# EAGLE schematic Aegis PCB - 1 v58 (EAGLE 9.7.0)

## Sheet 1 of 12: Battery Charger
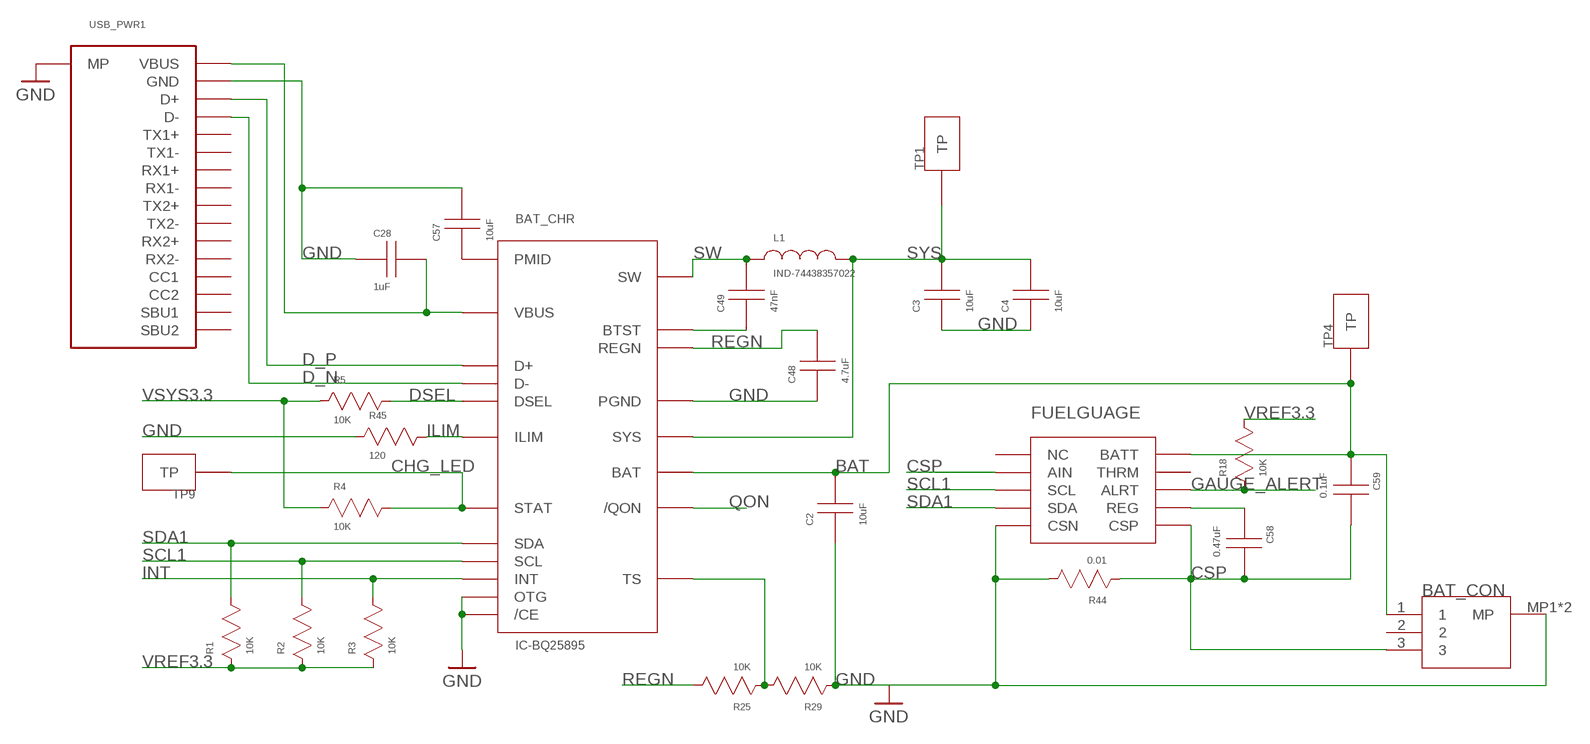
[diagram p0: schematic, sheet 1]

### Parts
BAT_CHR  IC-BQ25895  [IC-BQ25895]
BAT_CON  CONN-AUH03  [CONN_AUH03]
C2  10uF  CAP-603  [CAP-603]
C3  10uF  CAP-603  [CAP-603]
C4  10uF  CAP-603  [CAP-603]
C28  1uF  CAP-603  [CAP-603]
C48  4.7uF  CAP-603  [CAP-603]
C49  47nF  CAP-603  [CAP-603]
C57  10uF  CAP-603  [CAP-603]
C58  0.47uF  CAP-603  [CAP-603]
C59  0.1uF  CAP-603  [CAP-603]
FUELGUAGE  IC-MAX17055  [IC-MAX17055]
L1  IND-74438357022  [IND-74438357022]
R1  10K  RES-603  [RES-603]
R2  10K  RES-603  [RES-603]
R3  10K  RES-603  [RES-603]
R4  10K  RES-603  [RES-603]
R5  10K  RES-603  [RES-603]
R18  10K  RES-603  [RES-603]
R25  10K  RES-603  [RES-603]
R29  10K  RES-603  [RES-603]
R44  0.01  RES-603  [RES-603]
R45  120  RES-603  [RES-603]
TP1  TESTPOINT  [TESTPOINT]
TP4  TESTPOINT  [TESTPOINT]
TP9  TESTPOINT  [TESTPOINT]
USB_PWR1  USBC-USB-C31-S-RA-CS1D-BK-T/R  [USBC-USB-C31-S-RA-CS1D-BK-T/R]

### Nets
BAT: BAT_CHR.BAT1(BAT) BAT_CHR.BAT2(BAT) BAT_CON.1 C2.C C59.A FUELGUAGE.BATT TP4.TP
CHG_LED: BAT_CHR.STAT R4.C TP9.TP ; also sheet 10
CSP: BAT_CON.3 C58.C C59.C FUELGUAGE.AIN FUELGUAGE.CSP FUELGUAGE.EP(CSP) R44.A
D_N: BAT_CHR.D- USB_PWR1.D- USB_PWR1.D-_2(D-)
D_P: BAT_CHR.D+ USB_PWR1.D+ USB_PWR1.D+_2(D+)
DSEL: BAT_CHR.DSEL R5.C
GAUGE_ALERT: FUELGUAGE.ALRT R18.A ; also sheet 8
GND: BAT_CHR./CE BAT_CHR.OTG BAT_CHR.PGND1(PGND) BAT_CHR.PGND2(PGND) BAT_CHR.PWRPAD(PGND) BAT_CON.MP1(MP) BAT_CON.MP2(MP) C2.A C3.A C4.A C28.A C48.A C57.C FUELGUAGE.CSN R29.A R44.C R45.A USB_PWR1.GND_1(GND) USB_PWR1.GND_2(GND) USB_PWR1.GND_3(GND) USB_PWR1.GND_4(GND) USB_PWR1.MP_1(MP) USB_PWR1.MP_2(MP) USB_PWR1.MP_3(MP) USB_PWR1.MP_4(MP) ; also sheet 2,3,4,5,6,7,8,9,10,11,12
ILIM: BAT_CHR.ILIM R45.C
INT: BAT_CHR.INT R3.C ; also sheet 8
N$1: BAT_CHR.BTST C49.A
N$2: BAT_CHR.VBUS C28.C USB_PWR1.VBUS_1(VBUS) USB_PWR1.VBUS_2(VBUS) USB_PWR1.VBUS_3(VBUS) USB_PWR1.VBUS_4(VBUS)
N$4: BAT_CHR.TS R25.A R29.C
N$11: BAT_CHR.PMID C57.A
N$67: C58.A FUELGUAGE.REG
QON: BAT_CHR./QON
REGN: BAT_CHR.REGN C48.C R25.C
SCL1: BAT_CHR.SCL FUELGUAGE.SCL R2.C ; also sheet 8
SDA1: BAT_CHR.SDA FUELGUAGE.SDA R1.C ; also sheet 8
SW: BAT_CHR.SW1(SW) BAT_CHR.SW2(SW) C49.C L1.A
SYS: BAT_CHR.SYS1(SYS) BAT_CHR.SYS2(SYS) C3.C C4.C L1.C TP1.TP ; also sheet 2,3
VREF3.3: R1.A R2.A R3.A R18.C ; also sheet 4,9,10,11,12
VSYS3.3: R4.A R5.A ; also sheet 3,4,10
Unconnected: BAT_CON.2 FUELGUAGE.NC FUELGUAGE.THRM USB_PWR1.CC1 USB_PWR1.CC2 USB_PWR1.RX1+ USB_PWR1.RX1- USB_PWR1.RX2+ USB_PWR1.RX2- USB_PWR1.SBU1 USB_PWR1.SBU2 USB_PWR1.TX1+ USB_PWR1.TX1- USB_PWR1.TX2+ USB_PWR1.TX2-

## Sheet 2 of 12: 5V Regulator
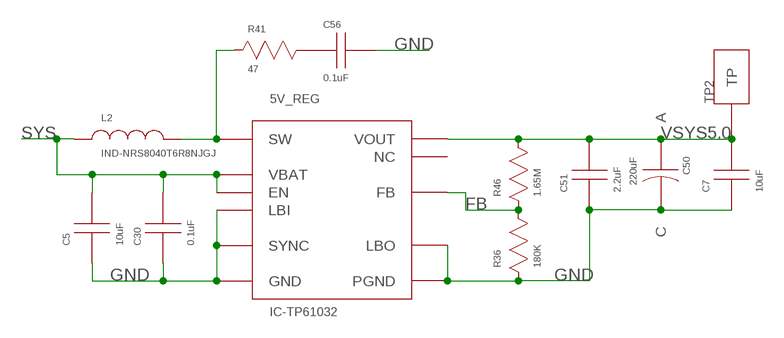
[diagram p1: schematic, sheet 2]

### Parts
5V_REG  IC-TP61032  [IC-TPS61032]
C5  10uF  CAP-603  [CAP-603]
C7  10uF  CAP-603  [CAP-603]
C30  0.1uF  CAP-603  [CAP-603]
C50  220uF  CAP-TAN-1411  [CAP-TAN-1411]
C51  2.2uF  CAP-603  [CAP-603]
C56  0.1uF  CAP-603  [CAP-603]
L2  IND-NRS8040T6R8NJGJ  [IND-NRS8040T6R8NJGJ]
R36  180K  RES-603  [RES-603]
R41  47  RES-603  [RES-603]
R46  1.65M  RES-603  [RES-603]
TP2  TESTPOINT  [TESTPOINT]

### Nets
FB: 5V_REG.FB R36.C R46.A
GND: 5V_REG.GND 5V_REG.LBI 5V_REG.LBO 5V_REG.PGND1(PGND) 5V_REG.PGND2(PGND) 5V_REG.PGND3(PGND) 5V_REG.PWRPAD(PGND) 5V_REG.SYNC C5.A C7.A C30.A C50.C C51.A C56.C R36.A ; also sheet 1,3,4,5,6,7,8,9,10,11,12
N$6: C56.A R41.C
SNUB: 5V_REG.SW1(SW) 5V_REG.SW2(SW) L2.C R41.A
SYS: 5V_REG.EN 5V_REG.VBAT C5.C C30.C L2.A ; also sheet 1,3
VSYS5.0: 5V_REG.VOUT1(VOUT) 5V_REG.VOUT2(VOUT) 5V_REG.VOUT3(VOUT) C7.C C50.A C51.C R46.C TP2.TP ; also sheet 4
Unconnected: 5V_REG.NC

## Sheet 3 of 12: 3.3V Regulator
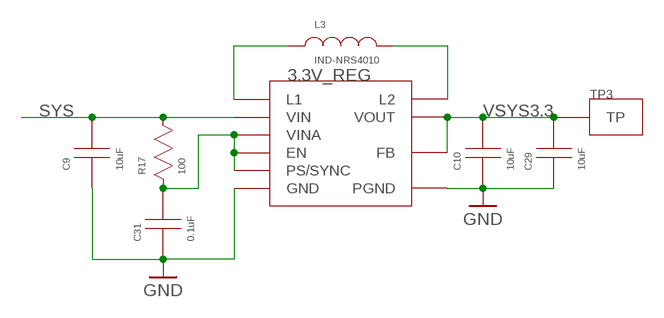
[diagram p2: schematic, sheet 3]

### Parts
3.3V_REG  IC-TPS63001DRCR  [IC-TPS63001DRCR]
C9  10uF  CAP-603  [CAP-603]
C10  10uF  CAP-603  [CAP-603]
C29  10uF  CAP-603  [CAP-603]
C31  0.1uF  CAP-603  [CAP-603]
L3  IND-NRS4010  [IND-NRS4010]
R17  100  RES-603  [RES-603]
TP3  TESTPOINT  [TESTPOINT]

### Nets
GND: 3.3V_REG.GND 3.3V_REG.PGND 3.3V_REG.PGND_1(PGND) 3.3V_REG.PGND_2(PGND) 3.3V_REG.PGND_3(PGND) 3.3V_REG.PGND_4(PGND) 3.3V_REG.PGND_5(PGND) C9.A C10.A C29.A C31.A ; also sheet 1,2,4,5,6,7,8,9,10,11,12
N$8: 3.3V_REG.EN 3.3V_REG.PS/SYNC 3.3V_REG.VINA C31.C R17.A
N$63: 3.3V_REG.L1 L3.A
N$66: 3.3V_REG.L2 L3.C
SYS: 3.3V_REG.VIN C9.C R17.C ; also sheet 1,2
VSYS3.3: 3.3V_REG.FB 3.3V_REG.VOUT C10.C C29.C TP3.TP ; also sheet 1,4,10

## Sheet 4 of 12: Power Switch
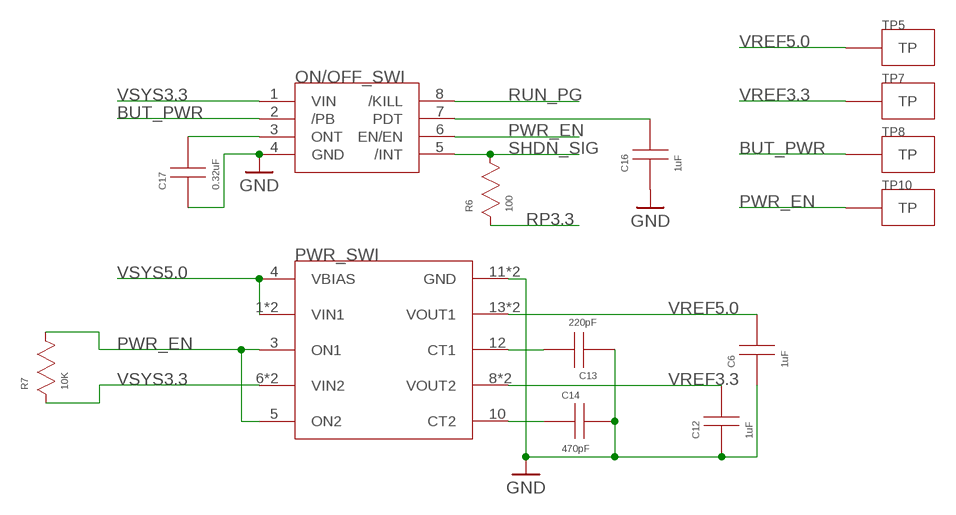
[diagram p3: schematic, sheet 4]

### Parts
C6  1uF  CAP-603  [CAP-603]
C12  1uF  CAP-603  [CAP-603]
C13  220pF  CAP-603  [CAP-603]
C14  470pF  CAP-603  [CAP-603]
C16  1uF  CAP-603  [CAP-603]
C17  0.32uF  CAP-603  [CAP-603]
ON/OFF_SWI  IC-LTC2954  [IC-LTC2954]
PWR_SWI  IC-TPS22976  [IC-TPS22976]
R6  100  RES-603  [RES-603]
R7  10K  RES-603  [RES-603]
TP5  TESTPOINT  [TESTPOINT]
TP7  TESTPOINT  [TESTPOINT]
TP8  TESTPOINT  [TESTPOINT]
TP10  TESTPOINT  [TESTPOINT]

### Nets
BUT_PWR: ON/OFF_SWI.2(/PB) TP8.TP ; also sheet 10
GND: C6.A C12.A C13.A C14.C C16.A C17.A ON/OFF_SWI.4(GND) PWR_SWI.11(GND) PWR_SWI.15(GND) ; also sheet 1,2,3,5,6,7,8,9,10,11,12
N$3: C13.C PWR_SWI.12(CT1)
N$5: C14.A PWR_SWI.10(CT2)
N$7: C16.C ON/OFF_SWI.7(PDT)
N$9: C17.C ON/OFF_SWI.3(ONT)
PWR_EN: ON/OFF_SWI.6(EN/EN) PWR_SWI.3(ON1) PWR_SWI.5(ON2) R7.C TP10.TP
RP3.3: R6.A ; also sheet 6,8,9
RUN_PG: ON/OFF_SWI.8(/KILL) ; also sheet 8
SHDN_SIG: ON/OFF_SWI.5(/INT) R6.C ; also sheet 8
VREF3.3: C12.C PWR_SWI.8(VOUT2) PWR_SWI.9(VOUT2) TP7.TP ; also sheet 1,9,10,11,12
VREF5.0: C6.C PWR_SWI.13(VOUT1) PWR_SWI.14(VOUT1) TP5.TP ; also sheet 7,8,11
VSYS3.3: ON/OFF_SWI.1(VIN) PWR_SWI.6(VIN2) PWR_SWI.7(VIN2) R7.A ; also sheet 1,3,10
VSYS5.0: PWR_SWI.1(VIN1) PWR_SWI.2(VIN1) PWR_SWI.4(VBIAS) ; also sheet 2

## Sheet 5 of 12: Audio
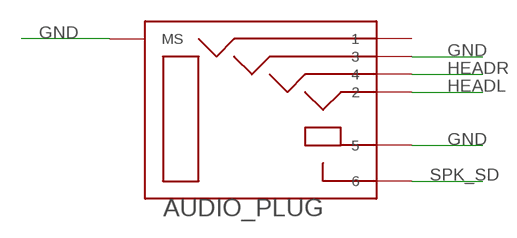
[diagram p4: schematic, sheet 5]

### Parts
AUDIO_PLUG  AUDIOPLUG-ASJ-192-Y-TR  [AUDIOPLUG-ASJ-192-Y-TR]

### Nets
GND: AUDIO_PLUG.3 AUDIO_PLUG.5 AUDIO_PLUG.MS1(MS) AUDIO_PLUG.MS2(MS) ; also sheet 1,2,3,4,6,7,8,9,10,11,12
HEADL: AUDIO_PLUG.2 ; also sheet 10
HEADR: AUDIO_PLUG.4 ; also sheet 10
SPK_SD: AUDIO_PLUG.6 ; also sheet 10
Unconnected: AUDIO_PLUG.1

## Sheet 6 of 12: MicroSD
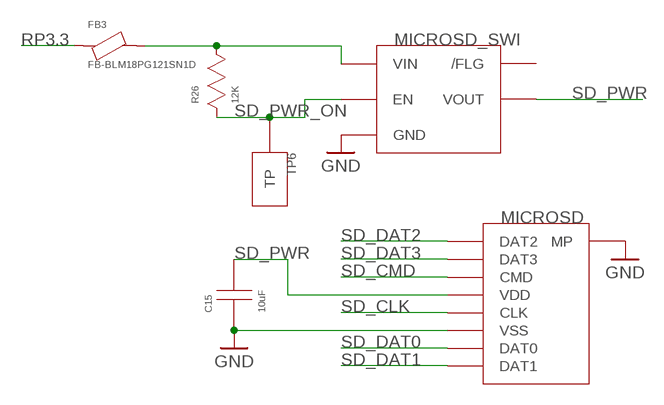
[diagram p5: schematic, sheet 6]

### Parts
C15  10uF  CAP-603  [CAP-603]
FB3  FB-BLM18PG121SN1D  [FB-BLM18PG121SN1D]
MICROSD  MICROSD-5033981892_SD  [MICROSD-5033981892_SD]
MICROSD_SWI  IC-RT9742  [IC-RT9742]
R26  12K  RES-603  [RES-603]
TP6  TESTPOINT  [TESTPOINT]

### Nets
GND: C15.A MICROSD.DL(MP) MICROSD.DS(MP) MICROSD.MP_1(MP) MICROSD.MP_2(MP) MICROSD.MP_3(MP) MICROSD.MP_4(MP) MICROSD.VSS MICROSD_SWI.GND ; also sheet 1,2,3,4,5,7,8,9,10,11,12
N$20: FB3.C MICROSD_SWI.VIN R26.C
RP3.3: FB3.A ; also sheet 4,8,9
SD_CLK: MICROSD.CLK ; also sheet 8
SD_CMD: MICROSD.CMD ; also sheet 8
SD_DAT0: MICROSD.DAT0 ; also sheet 8
SD_DAT1: MICROSD.DAT1 ; also sheet 8
SD_DAT2: MICROSD.DAT2 ; also sheet 8
SD_DAT3: MICROSD.DAT3 ; also sheet 8
SD_PWR: C15.C MICROSD.VDD MICROSD_SWI.VOUT
SD_PWR_ON: MICROSD_SWI.EN R26.A TP6.TP ; also sheet 8
Unconnected: MICROSD_SWI./FLG

## Sheet 7 of 12: HDMI
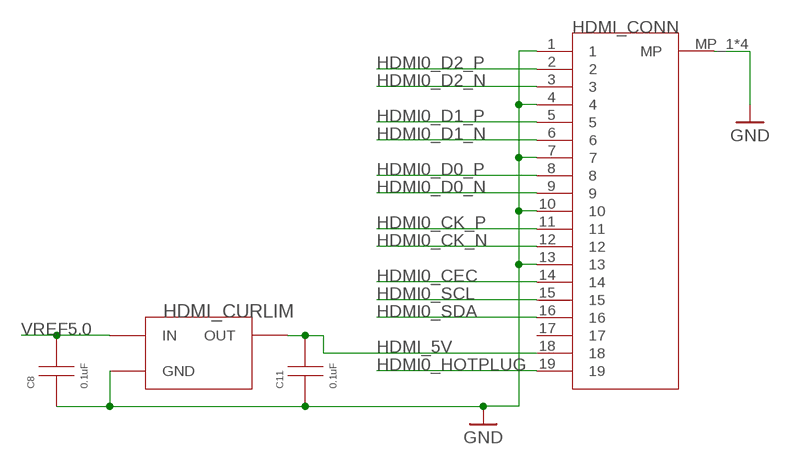
[diagram p6: schematic, sheet 7]

### Parts
C8  0.1uF  CAP-603  [CAP-603]
C11  0.1uF  CAP-603  [CAP-603]
HDMI_CONN  HDMI-2001-1-2-21-00-BK  [HDMI-2001-1-2-21-00-BK]
HDMI_CURLIM  CURLIM-AP2331  [CURLIM-AP2331]

### Nets
GND: C8.A C11.A HDMI_CONN.1 HDMI_CONN.4 HDMI_CONN.7 HDMI_CONN.10 HDMI_CONN.13 HDMI_CONN.MP_1(MP) HDMI_CONN.MP_2(MP) HDMI_CONN.MP_3(MP) HDMI_CONN.MP_4(MP) HDMI_CURLIM.GND ; also sheet 1,2,3,4,5,6,8,9,10,11,12
HDMI0_CEC: HDMI_CONN.14 ; also sheet 8
HDMI0_CK_N: HDMI_CONN.12 ; also sheet 8
HDMI0_CK_P: HDMI_CONN.11 ; also sheet 8
HDMI0_D0_N: HDMI_CONN.9 ; also sheet 8
HDMI0_D0_P: HDMI_CONN.8 ; also sheet 8
HDMI0_D1_N: HDMI_CONN.6 ; also sheet 8
HDMI0_D1_P: HDMI_CONN.5 ; also sheet 8
HDMI0_D2_N: HDMI_CONN.3 ; also sheet 8
HDMI0_D2_P: HDMI_CONN.2 ; also sheet 8
HDMI0_HOTPLUG: HDMI_CONN.19 ; also sheet 8
HDMI0_SCL: HDMI_CONN.15 ; also sheet 8
HDMI0_SDA: HDMI_CONN.16 ; also sheet 8
HDMI_5V: C11.C HDMI_CONN.18 HDMI_CURLIM.OUT
VREF5.0: C8.C HDMI_CURLIM.IN ; also sheet 4,8,11
Unconnected: HDMI_CONN.17

## Sheet 8 of 12: Raspberry PI CM4
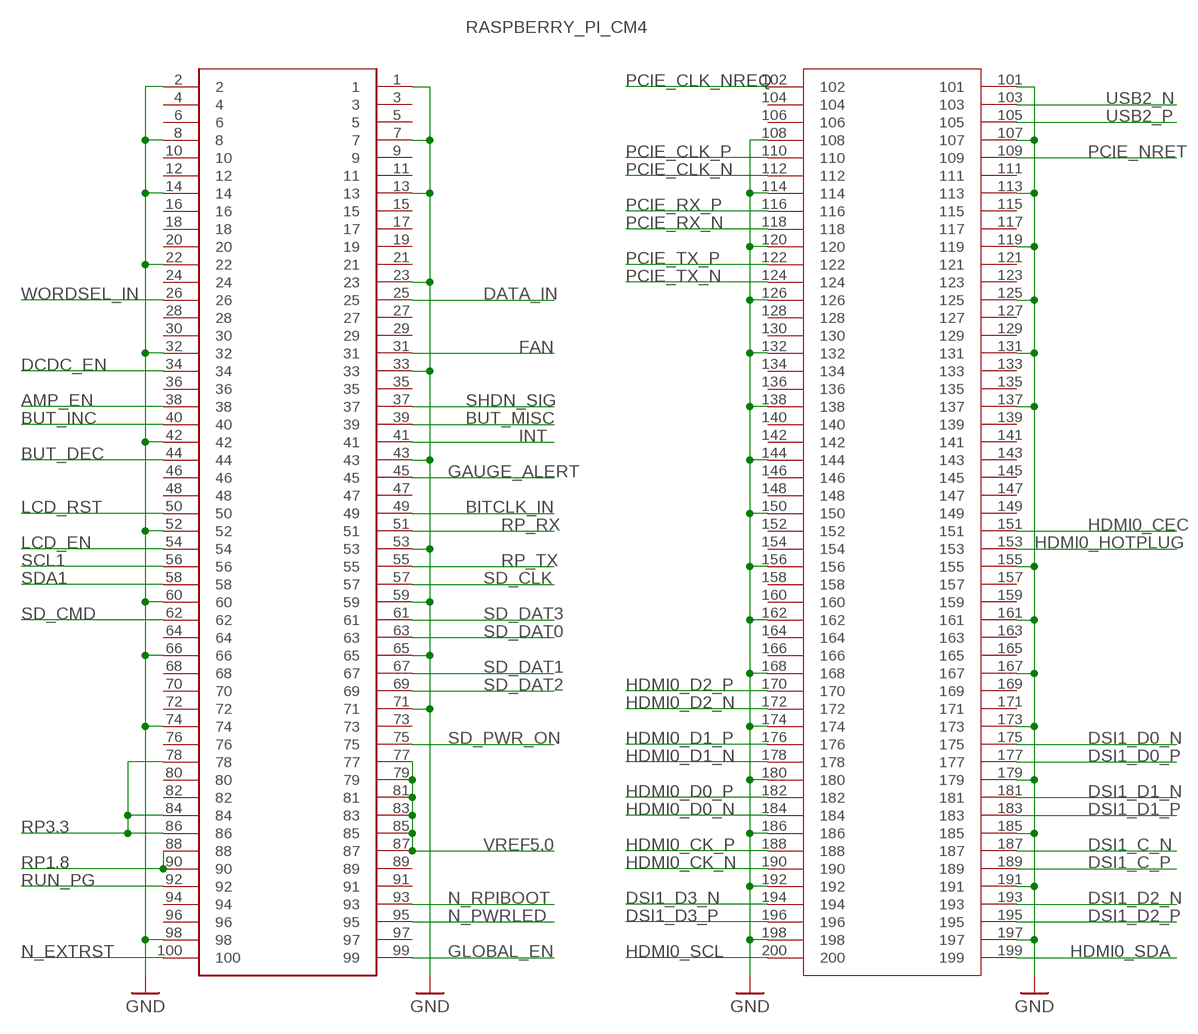
[diagram p7: schematic, sheet 8]

### Parts
RASPBERRY_PI_CM4  RP_CM4  [RP_CM4]

### Nets
AMP_EN: RASPBERRY_PI_CM4.38 ; also sheet 10
BITCLK_IN: RASPBERRY_PI_CM4.49 ; also sheet 10
BUT_DEC: RASPBERRY_PI_CM4.44 ; also sheet 10
BUT_INC: RASPBERRY_PI_CM4.40 ; also sheet 10
BUT_MISC: RASPBERRY_PI_CM4.39 ; also sheet 10
DATA_IN: RASPBERRY_PI_CM4.25 ; also sheet 10
DCDC_EN: RASPBERRY_PI_CM4.34 ; also sheet 9
DSI1_C_N [Mipi]: RASPBERRY_PI_CM4.187 ; also sheet 9
DSI1_C_P [Mipi]: RASPBERRY_PI_CM4.189 ; also sheet 9
DSI1_D0_N [Mipi]: RASPBERRY_PI_CM4.175 ; also sheet 9
DSI1_D0_P [Mipi]: RASPBERRY_PI_CM4.177 ; also sheet 9
DSI1_D1_N [Mipi]: RASPBERRY_PI_CM4.181 ; also sheet 9
DSI1_D1_P [Mipi]: RASPBERRY_PI_CM4.183 ; also sheet 9
DSI1_D2_N [Mipi]: RASPBERRY_PI_CM4.193 ; also sheet 9
DSI1_D2_P [Mipi]: RASPBERRY_PI_CM4.195 ; also sheet 9
DSI1_D3_N [Mipi]: RASPBERRY_PI_CM4.194 ; also sheet 9
DSI1_D3_P [Mipi]: RASPBERRY_PI_CM4.196 ; also sheet 9
FAN: RASPBERRY_PI_CM4.31 ; also sheet 12
GAUGE_ALERT: RASPBERRY_PI_CM4.45 ; also sheet 1
GLOBAL_EN: RASPBERRY_PI_CM4.99
GND: RASPBERRY_PI_CM4.1 RASPBERRY_PI_CM4.2 RASPBERRY_PI_CM4.7 RASPBERRY_PI_CM4.8 RASPBERRY_PI_CM4.13 RASPBERRY_PI_CM4.14 RASPBERRY_PI_CM4.22 RASPBERRY_PI_CM4.23 RASPBERRY_PI_CM4.32 RASPBERRY_PI_CM4.33 RASPBERRY_PI_CM4.42 RASPBERRY_PI_CM4.43 RASPBERRY_PI_CM4.52 RASPBERRY_PI_CM4.53 RASPBERRY_PI_CM4.59 RASPBERRY_PI_CM4.60 RASPBERRY_PI_CM4.65 RASPBERRY_PI_CM4.66 RASPBERRY_PI_CM4.71 RASPBERRY_PI_CM4.74 RASPBERRY_PI_CM4.98 RASPBERRY_PI_CM4.101 RASPBERRY_PI_CM4.107 RASPBERRY_PI_CM4.108 RASPBERRY_PI_CM4.113 RASPBERRY_PI_CM4.114 RASPBERRY_PI_CM4.119 RASPBERRY_PI_CM4.120 RASPBERRY_PI_CM4.125 RASPBERRY_PI_CM4.126 RASPBERRY_PI_CM4.131 RASPBERRY_PI_CM4.132 RASPBERRY_PI_CM4.137 RASPBERRY_PI_CM4.138 RASPBERRY_PI_CM4.144 RASPBERRY_PI_CM4.150 RASPBERRY_PI_CM4.155 RASPBERRY_PI_CM4.156 RASPBERRY_PI_CM4.161 RASPBERRY_PI_CM4.162 RASPBERRY_PI_CM4.167 RASPBERRY_PI_CM4.168 RASPBERRY_PI_CM4.173 RASPBERRY_PI_CM4.174 RASPBERRY_PI_CM4.179 RASPBERRY_PI_CM4.180 RASPBERRY_PI_CM4.185 RASPBERRY_PI_CM4.186 RASPBERRY_PI_CM4.191 RASPBERRY_PI_CM4.192 RASPBERRY_PI_CM4.197 RASPBERRY_PI_CM4.198 ; also sheet 1,2,3,4,5,6,7,9,10,11,12
HDMI0_CEC: RASPBERRY_PI_CM4.151 ; also sheet 7
HDMI0_CK_N: RASPBERRY_PI_CM4.190 ; also sheet 7
HDMI0_CK_P: RASPBERRY_PI_CM4.188 ; also sheet 7
HDMI0_D0_N: RASPBERRY_PI_CM4.184 ; also sheet 7
HDMI0_D0_P: RASPBERRY_PI_CM4.182 ; also sheet 7
HDMI0_D1_N: RASPBERRY_PI_CM4.178 ; also sheet 7
HDMI0_D1_P: RASPBERRY_PI_CM4.176 ; also sheet 7
HDMI0_D2_N: RASPBERRY_PI_CM4.172 ; also sheet 7
HDMI0_D2_P: RASPBERRY_PI_CM4.170 ; also sheet 7
HDMI0_HOTPLUG: RASPBERRY_PI_CM4.153 ; also sheet 7
HDMI0_SCL: RASPBERRY_PI_CM4.200 ; also sheet 7
HDMI0_SDA: RASPBERRY_PI_CM4.199 ; also sheet 7
INT: RASPBERRY_PI_CM4.41 ; also sheet 1
LCD_EN: RASPBERRY_PI_CM4.54 ; also sheet 9
LCD_RST: RASPBERRY_PI_CM4.50 ; also sheet 9
N_EXTRST: RASPBERRY_PI_CM4.100 ; also sheet 11
N_PWRLED: RASPBERRY_PI_CM4.95 ; also sheet 10
N_RPIBOOT: RASPBERRY_PI_CM4.93
PCIE_CLK_N: RASPBERRY_PI_CM4.112
PCIE_CLK_NREQ: RASPBERRY_PI_CM4.102
PCIE_CLK_P: RASPBERRY_PI_CM4.110
PCIE_NRET: RASPBERRY_PI_CM4.109
PCIE_RX_N: RASPBERRY_PI_CM4.118
PCIE_RX_P: RASPBERRY_PI_CM4.116
PCIE_TX_N: RASPBERRY_PI_CM4.124
PCIE_TX_P: RASPBERRY_PI_CM4.122
RP1.8: RASPBERRY_PI_CM4.88 RASPBERRY_PI_CM4.90 ; also sheet 9
RP3.3: RASPBERRY_PI_CM4.78 RASPBERRY_PI_CM4.84 RASPBERRY_PI_CM4.86 ; also sheet 4,6,9
RP_RX: RASPBERRY_PI_CM4.51 ; also sheet 10
RP_TX: RASPBERRY_PI_CM4.55 ; also sheet 10
RUN_PG: RASPBERRY_PI_CM4.92 ; also sheet 4
SCL1: RASPBERRY_PI_CM4.56 ; also sheet 1
SD_CLK: RASPBERRY_PI_CM4.57 ; also sheet 6
SD_CMD: RASPBERRY_PI_CM4.62 ; also sheet 6
SD_DAT0: RASPBERRY_PI_CM4.63 ; also sheet 6
SD_DAT1: RASPBERRY_PI_CM4.67 ; also sheet 6
SD_DAT2: RASPBERRY_PI_CM4.69 ; also sheet 6
SD_DAT3: RASPBERRY_PI_CM4.61 ; also sheet 6
SD_PWR_ON: RASPBERRY_PI_CM4.75 ; also sheet 6
SDA1: RASPBERRY_PI_CM4.58 ; also sheet 1
SHDN_SIG: RASPBERRY_PI_CM4.37 ; also sheet 4
USB2_N: RASPBERRY_PI_CM4.103 ; also sheet 11
USB2_P: RASPBERRY_PI_CM4.105 ; also sheet 11
VREF5.0: RASPBERRY_PI_CM4.77 RASPBERRY_PI_CM4.79 RASPBERRY_PI_CM4.81 RASPBERRY_PI_CM4.83 RASPBERRY_PI_CM4.85 RASPBERRY_PI_CM4.87 ; also sheet 4,7,11
WORDSEL_IN: RASPBERRY_PI_CM4.26 ; also sheet 10
Unconnected: RASPBERRY_PI_CM4.3 RASPBERRY_PI_CM4.4 RASPBERRY_PI_CM4.5 RASPBERRY_PI_CM4.6 RASPBERRY_PI_CM4.9 RASPBERRY_PI_CM4.10 RASPBERRY_PI_CM4.11 RASPBERRY_PI_CM4.12 RASPBERRY_PI_CM4.15 RASPBERRY_PI_CM4.16 RASPBERRY_PI_CM4.17 RASPBERRY_PI_CM4.18 RASPBERRY_PI_CM4.19 RASPBERRY_PI_CM4.20 RASPBERRY_PI_CM4.21 RASPBERRY_PI_CM4.24 RASPBERRY_PI_CM4.27 RASPBERRY_PI_CM4.28 RASPBERRY_PI_CM4.29 RASPBERRY_PI_CM4.30 RASPBERRY_PI_CM4.35 RASPBERRY_PI_CM4.36 RASPBERRY_PI_CM4.46 RASPBERRY_PI_CM4.47 RASPBERRY_PI_CM4.48 RASPBERRY_PI_CM4.64 RASPBERRY_PI_CM4.68 RASPBERRY_PI_CM4.70 RASPBERRY_PI_CM4.72 RASPBERRY_PI_CM4.73 RASPBERRY_PI_CM4.76 RASPBERRY_PI_CM4.80 RASPBERRY_PI_CM4.82 RASPBERRY_PI_CM4.89 RASPBERRY_PI_CM4.91 RASPBERRY_PI_CM4.94 RASPBERRY_PI_CM4.96 RASPBERRY_PI_CM4.97 RASPBERRY_PI_CM4.104 RASPBERRY_PI_CM4.106 RASPBERRY_PI_CM4.111 RASPBERRY_PI_CM4.115 RASPBERRY_PI_CM4.117 RASPBERRY_PI_CM4.121 RASPBERRY_PI_CM4.123 RASPBERRY_PI_CM4.127 RASPBERRY_PI_CM4.128 RASPBERRY_PI_CM4.129 RASPBERRY_PI_CM4.130 RASPBERRY_PI_CM4.133 RASPBERRY_PI_CM4.134 RASPBERRY_PI_CM4.135 RASPBERRY_PI_CM4.136 RASPBERRY_PI_CM4.139 RASPBERRY_PI_CM4.140 RASPBERRY_PI_CM4.141 RASPBERRY_PI_CM4.142 RASPBERRY_PI_CM4.143 RASPBERRY_PI_CM4.145 RASPBERRY_PI_CM4.146 RASPBERRY_PI_CM4.147 RASPBERRY_PI_CM4.148 RASPBERRY_PI_CM4.149 RASPBERRY_PI_CM4.152 RASPBERRY_PI_CM4.154 RASPBERRY_PI_CM4.157 RASPBERRY_PI_CM4.158 RASPBERRY_PI_CM4.159 RASPBERRY_PI_CM4.160 RASPBERRY_PI_CM4.163 RASPBERRY_PI_CM4.164 RASPBERRY_PI_CM4.165 RASPBERRY_PI_CM4.166 RASPBERRY_PI_CM4.169 RASPBERRY_PI_CM4.171

## Sheet 9 of 12: Screen
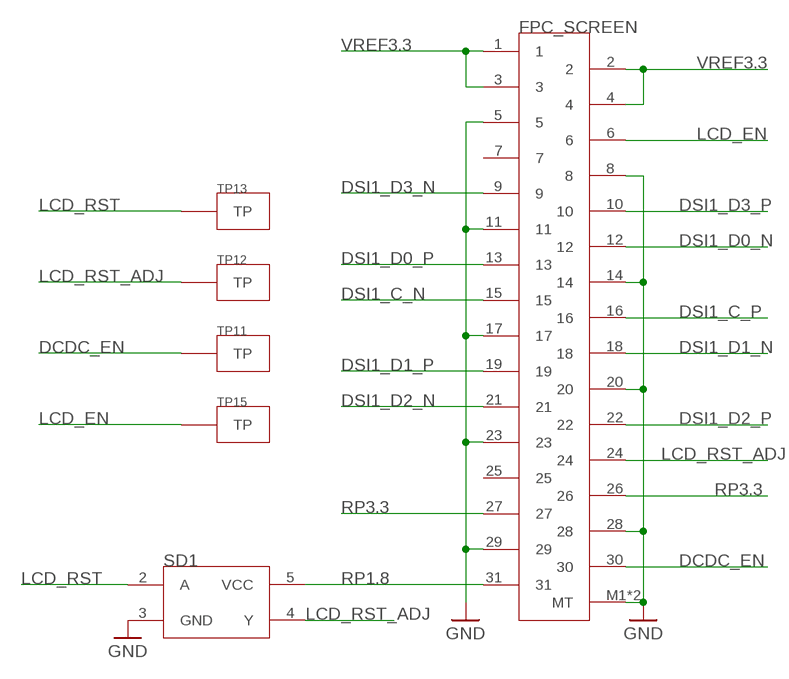
[diagram p8: schematic, sheet 9]

### Parts
FPC_SCREEN  CONN-FH35C-31S-0.3SHW  [CONN-FH35C-31S-0.3SHW]
SD1  SCHDIODE-SN74LVC1G17  [SCHDIODE-SN74LVC1G17]
TP11  TESTPOINT  [TESTPOINT]
TP12  TESTPOINT  [TESTPOINT]
TP13  TESTPOINT  [TESTPOINT]
TP15  TESTPOINT  [TESTPOINT]

### Nets
DCDC_EN: FPC_SCREEN.30 TP11.TP ; also sheet 8
DSI1_C_N [Mipi]: FPC_SCREEN.15 ; also sheet 8
DSI1_C_P [Mipi]: FPC_SCREEN.16 ; also sheet 8
DSI1_D0_N [Mipi]: FPC_SCREEN.12 ; also sheet 8
DSI1_D0_P [Mipi]: FPC_SCREEN.13 ; also sheet 8
DSI1_D1_N [Mipi]: FPC_SCREEN.18 ; also sheet 8
DSI1_D1_P [Mipi]: FPC_SCREEN.19 ; also sheet 8
DSI1_D2_N [Mipi]: FPC_SCREEN.21 ; also sheet 8
DSI1_D2_P [Mipi]: FPC_SCREEN.22 ; also sheet 8
DSI1_D3_N [Mipi]: FPC_SCREEN.9 ; also sheet 8
DSI1_D3_P [Mipi]: FPC_SCREEN.10 ; also sheet 8
GND: FPC_SCREEN.5 FPC_SCREEN.8 FPC_SCREEN.11 FPC_SCREEN.14 FPC_SCREEN.17 FPC_SCREEN.20 FPC_SCREEN.23 FPC_SCREEN.28 FPC_SCREEN.29 FPC_SCREEN.M1(MT) FPC_SCREEN.M2(MT) SD1.3(GND) ; also sheet 1,2,3,4,5,6,7,8,10,11,12
LCD_EN: FPC_SCREEN.6 TP15.TP ; also sheet 8
LCD_RST: SD1.2(A) TP13.TP ; also sheet 8
LCD_RST_ADJ: FPC_SCREEN.24 SD1.4(Y) TP12.TP
RP1.8: FPC_SCREEN.31 SD1.5(VCC) ; also sheet 8
RP3.3: FPC_SCREEN.26 FPC_SCREEN.27 ; also sheet 4,6,8
VREF3.3: FPC_SCREEN.1 FPC_SCREEN.2 FPC_SCREEN.3 FPC_SCREEN.4 ; also sheet 1,4,10,11,12
Unconnected: FPC_SCREEN.7 FPC_SCREEN.25

## Sheet 10 of 12: Board Connector
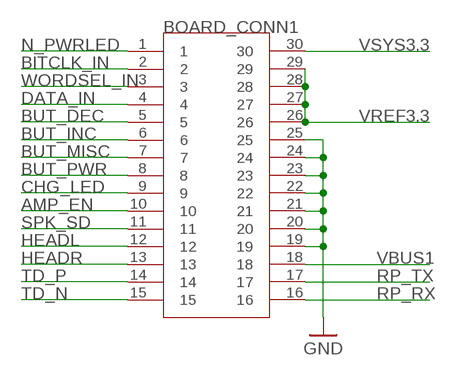
[diagram p9: schematic, sheet 10]

### Parts
BOARD_CONN1  CONN-AXK5F30347YG  [CONN-AXK5F30347YG]

### Nets
AMP_EN: BOARD_CONN1.10 ; also sheet 8
BITCLK_IN: BOARD_CONN1.2 ; also sheet 8
BUT_DEC: BOARD_CONN1.5 ; also sheet 8
BUT_INC: BOARD_CONN1.6 ; also sheet 8
BUT_MISC: BOARD_CONN1.7 ; also sheet 8
BUT_PWR: BOARD_CONN1.8 ; also sheet 4
CHG_LED: BOARD_CONN1.9 ; also sheet 1
DATA_IN: BOARD_CONN1.4 ; also sheet 8
GND: BOARD_CONN1.19 BOARD_CONN1.20 BOARD_CONN1.21 BOARD_CONN1.22 BOARD_CONN1.23 BOARD_CONN1.24 BOARD_CONN1.25 ; also sheet 1,2,3,4,5,6,7,8,9,11,12
HEADL: BOARD_CONN1.12 ; also sheet 5
HEADR: BOARD_CONN1.13 ; also sheet 5
N_PWRLED: BOARD_CONN1.1 ; also sheet 8
RP_RX: BOARD_CONN1.16 ; also sheet 8
RP_TX: BOARD_CONN1.17 ; also sheet 8
SPK_SD: BOARD_CONN1.11 ; also sheet 5
TD_N: BOARD_CONN1.15 ; also sheet 11
TD_P: BOARD_CONN1.14 ; also sheet 11
VBUS1: BOARD_CONN1.18 ; also sheet 11
VREF3.3: BOARD_CONN1.26 BOARD_CONN1.27 BOARD_CONN1.28 BOARD_CONN1.29 ; also sheet 1,4,9,11,12
VSYS3.3: BOARD_CONN1.30 ; also sheet 1,3,4
WORDSEL_IN: BOARD_CONN1.3 ; also sheet 8

## Sheet 11 of 12: USB
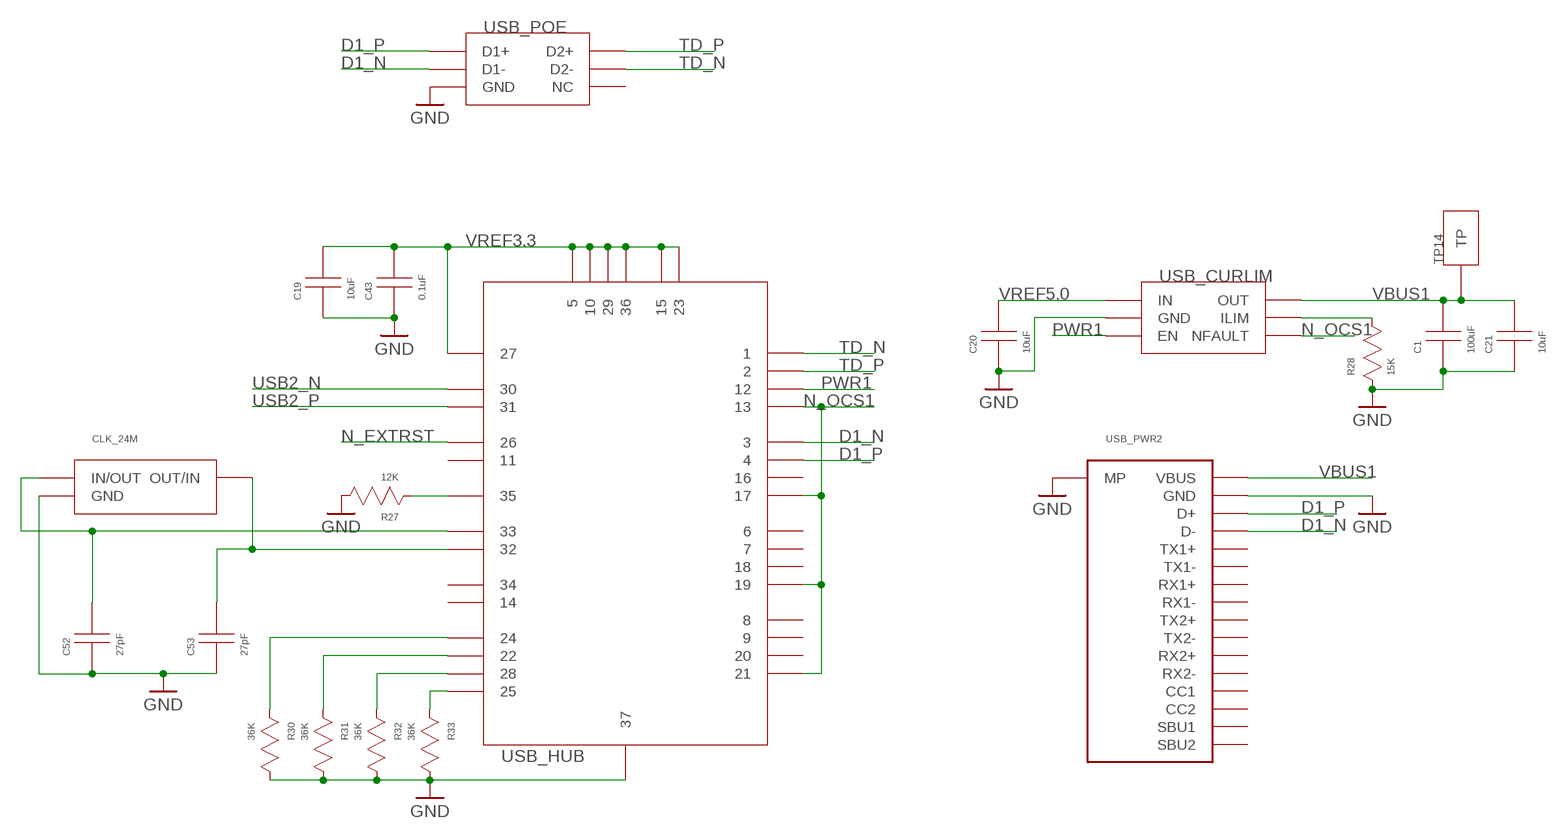
[diagram p10: schematic, sheet 11]

### Parts
C1  100uF  CAP-603  [CAP-603]
C19  10uF  CAP-603  [CAP-603]
C20  10uF  CAP-603  [CAP-603]
C21  10uF  CAP-603  [CAP-603]
C43  0.1uF  CAP-603  [CAP-603]
C52  27pF  CAP-603  [CAP-603]
C53  27pF  CAP-603  [CAP-603]
CLK_24M  CLK-ECS-240  [CLK-ECS-240]
R27  12K  RES-603  [RES-603]
R28  15K  RES-603  [RES-603]
R30  36K  RES-603  [RES-603]
R31  36K  RES-603  [RES-603]
R32  36K  RES-603  [RES-603]
R33  36K  RES-603  [RES-603]
TP14  TESTPOINT  [TESTPOINT]
USB_CURLIM  CURLIM-AP22653W6  [CURLIM-AP22653W6]
USB_HUB  USBPORT-USB2514BT-I/M2  [USBPORT-USB2514BT-I/M2]
USB_POE  POE_PROT-TPD4EUSB30DQAR  [POE_PROT-TPD4EUSB30DQAR]
USB_PWR2  USBC-USB-C31-S-RA-CS1D-BK-T/R  [USBC-USB-C31-S-RA-CS1D-BK-T/R]

### Nets
D1_N: USB_HUB.3 USB_POE.D1- USB_PWR2.D- USB_PWR2.D-_2(D-)
D1_P: USB_HUB.4 USB_POE.D1+ USB_PWR2.D+ USB_PWR2.D+_2(D+)
GND: C1.A C19.A C20.A C21.A C43.A C52.A C53.A CLK_24M.GND_1(GND) CLK_24M.GND_2(GND) R27.C R28.A R30.C R31.C R32.C R33.C USB_CURLIM.GND USB_HUB.37 USB_POE.GND_1(GND) USB_POE.GND_2(GND) USB_PWR2.GND_1(GND) USB_PWR2.GND_2(GND) USB_PWR2.GND_3(GND) USB_PWR2.GND_4(GND) USB_PWR2.MP_1(MP) USB_PWR2.MP_2(MP) USB_PWR2.MP_3(MP) USB_PWR2.MP_4(MP) ; also sheet 1,2,3,4,5,6,7,8,9,10,12
N$56: R32.A USB_HUB.28
N$57: R28.C USB_CURLIM.ILIM
N$58: R31.A USB_HUB.22
N$59: R30.A USB_HUB.24
N$61: C53.C CLK_24M.OUT/IN USB_HUB.32
N$62: C52.C CLK_24M.IN/OUT USB_HUB.33
N$64: R33.A USB_HUB.25
N$65: R27.A USB_HUB.35
N_EXTRST: USB_HUB.26 ; also sheet 8
N_OCS1: USB_CURLIM.NFAULT USB_HUB.13 USB_HUB.17 USB_HUB.19 USB_HUB.21
PWR1: USB_CURLIM.EN USB_HUB.12
TD_N: USB_HUB.1 USB_POE.D2- ; also sheet 10
TD_P: USB_HUB.2 USB_POE.D2+ ; also sheet 10
USB2_N: USB_HUB.30 ; also sheet 8
USB2_P: USB_HUB.31 ; also sheet 8
VBUS1: C1.C C21.C TP14.TP USB_CURLIM.OUT USB_PWR2.VBUS_1(VBUS) USB_PWR2.VBUS_2(VBUS) USB_PWR2.VBUS_3(VBUS) USB_PWR2.VBUS_4(VBUS) ; also sheet 10
VREF3.3: C19.C C43.C USB_HUB.5 USB_HUB.10 USB_HUB.15 USB_HUB.23 USB_HUB.27 USB_HUB.29 USB_HUB.36 ; also sheet 1,4,9,10,12
VREF5.0: C20.C USB_CURLIM.IN ; also sheet 4,7,8
Unconnected: USB_HUB.6 USB_HUB.7 USB_HUB.8 USB_HUB.9 USB_HUB.11 USB_HUB.14 USB_HUB.16 USB_HUB.18 USB_HUB.20 USB_HUB.34 USB_POE.NC_1(NC) USB_POE.NC_2(NC) USB_POE.NC_3(NC) USB_POE.NC_4(NC) USB_PWR2.CC1 USB_PWR2.CC2 USB_PWR2.RX1+ USB_PWR2.RX1- USB_PWR2.RX2+ USB_PWR2.RX2- USB_PWR2.SBU1 USB_PWR2.SBU2 USB_PWR2.TX1+ USB_PWR2.TX1- USB_PWR2.TX2+ USB_PWR2.TX2-

## Sheet 12 of 12
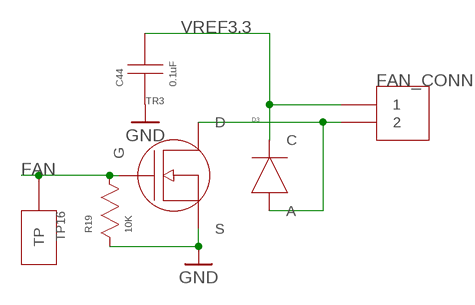
[diagram p11: schematic, sheet 12]

### Parts
C44  0.1uF  CAP-603  [CAP-603]
D3  DIODE-X3-WLB1608-2  [DIODE-X3-WLB1608-2]
FAN_CONN  CONN-282834-2  [CONN-282834-2]
R19  10K  RES-603  [RES-603]
TP16  TESTPOINT  [TESTPOINT]
TR3  TRAN-DMG2302UKQ  [TRAN-DMG2302UKQ]

### Nets
FAN: R19.C TP16.TP TR3.G ; also sheet 8
GND: C44.A R19.A TR3.S ; also sheet 1,2,3,4,5,6,7,8,9,10,11
N$55: D3.A FAN_CONN.2 TR3.D
VREF3.3: C44.C D3.C FAN_CONN.1 ; also sheet 1,4,9,10,11

## Library data of the parts
3.3V_REG = Personal:IC-TPS63001DRCR
5V_REG = Personal:IC-TP61032
AUDIO_PLUG = Personal:AUDIOPLUG-ASJ-192-Y-TR
BAT_CHR = Personal:IC-BQ25895
BAT_CON = Personal:CONN-AUH03
BOARD_CONN1 = Personal:CONN-AXK5F30347YG
C1-C17 C19-C21 C28-C31 C43 C44 C48 C49 C51-C53 C56-C59 = Personal:CAP-603
C50 = Personal:CAP-TAN-1411
CLK_24M = Personal:CLK-ECS-240
D3 = Personal:DIODE-X3-WLB1608-2
FAN_CONN = Personal:CONN-282834-2
FB3 = Personal:FB-BLM18PG121SN1D
FPC_SCREEN = Personal:CONN-FH35C-31S-0.3SHW
FUELGUAGE = Personal:IC-MAX17055
HDMI_CONN = Personal:HDMI-2001-1-2-21-00-BK
HDMI_CURLIM = Personal:CURLIM-AP2331
L1 = Personal:IND-74438357022
L2 = Personal:IND-NRS8040T6R8NJGJ
L3 = Personal:IND-NRS4010
MICROSD = Personal:MICROSD-5033981892_SD
MICROSD_SWI = Personal:IC-RT9742
ON/OFF_SWI = Personal:IC-LTC2954
PWR_SWI = Personal:IC-TPS22976
R1-R7 R17-R19 R25-R33 R36 R41 R44-R46 = Personal:RES-603
RASPBERRY_PI_CM4 = Personal:RP_CM4
SD1 = Personal:SCHDIODE-SN74LVC1G17
TP1-TP16 = Personal:TESTPOINT
TR3 = Personal:TRAN-DMG2302UKQ
USB_CURLIM = Personal:CURLIM-AP22653W6
USB_HUB = Personal:USBPORT-USB2514BT-I/M2
USB_POE = Personal:POE_PROT-TPD4EUSB30DQAR
USB_PWR1 USB_PWR2 = Personal:USBC-USB-C31-S-RA-CS1D-BK-T/R

## Net classes
1 PWR 1A: width 0.254 mm
2 Mipi: width 0.203 mm